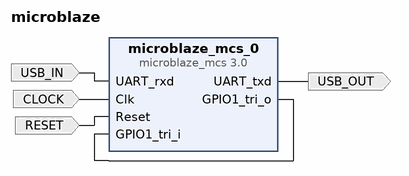
[diagram p0: block diagram of the top level]
# Vivado block design microblaze, Vivado 2016.2
create_bd_design microblaze

create_bd_port -dir I USB_IN
create_bd_port -dir O USB_OUT
create_bd_port -dir I -type clk CLOCK
set_property -dict {CONFIG.FREQ_HZ 100000000} [get_bd_ports CLOCK]
create_bd_port -dir I -type rst RESET
set_property -dict {CONFIG.POLARITY ACTIVE_HIGH} [get_bd_ports RESET]

create_bd_cell -type ip -vlnv xilinx.com:ip:microblaze_mcs:3.0 microblaze_mcs_0
set_property -dict [list \
  CONFIG.MEMSIZE 65536 \
  CONFIG.USE_IO_BUS 0 \
  CONFIG.USE_UART_RX 1 \
  CONFIG.USE_UART_TX 1 \
  CONFIG.USE_GPO1 1 \
  CONFIG.USE_GPO2 0 \
  CONFIG.USE_GPO3 0 \
  CONFIG.USE_GPO4 0 \
  CONFIG.USE_GPI1 1 \
  CONFIG.GPI1_SIZE 32 \
  CONFIG.USE_GPI2 0 \
  CONFIG.USE_GPI3 0 \
  CONFIG.USE_GPI4 0 \
  CONFIG.USE_BOARD_FLOW true \
  CONFIG.GPIO1_BOARD_INTERFACE Custom \
  CONFIG.GPIO2_BOARD_INTERFACE Custom \
  CONFIG.GPIO3_BOARD_INTERFACE Custom \
  CONFIG.GPIO4_BOARD_INTERFACE Custom \
  CONFIG.UART_BOARD_INTERFACE Custom \
] [get_bd_cells microblaze_mcs_0]

# ---- connections ----

connect_bd_net [get_bd_ports USB_IN] [get_bd_pins microblaze_mcs_0/UART_rxd]
connect_bd_net [get_bd_pins microblaze_mcs_0/UART_txd] [get_bd_ports USB_OUT]
connect_bd_net [get_bd_ports CLOCK] [get_bd_pins microblaze_mcs_0/Clk]
connect_bd_net [get_bd_ports RESET] [get_bd_pins microblaze_mcs_0/Reset]
connect_bd_net [get_bd_pins microblaze_mcs_0/GPIO1_tri_o] [get_bd_pins microblaze_mcs_0/GPIO1_tri_i]

validate_bd_design
save_bd_design
